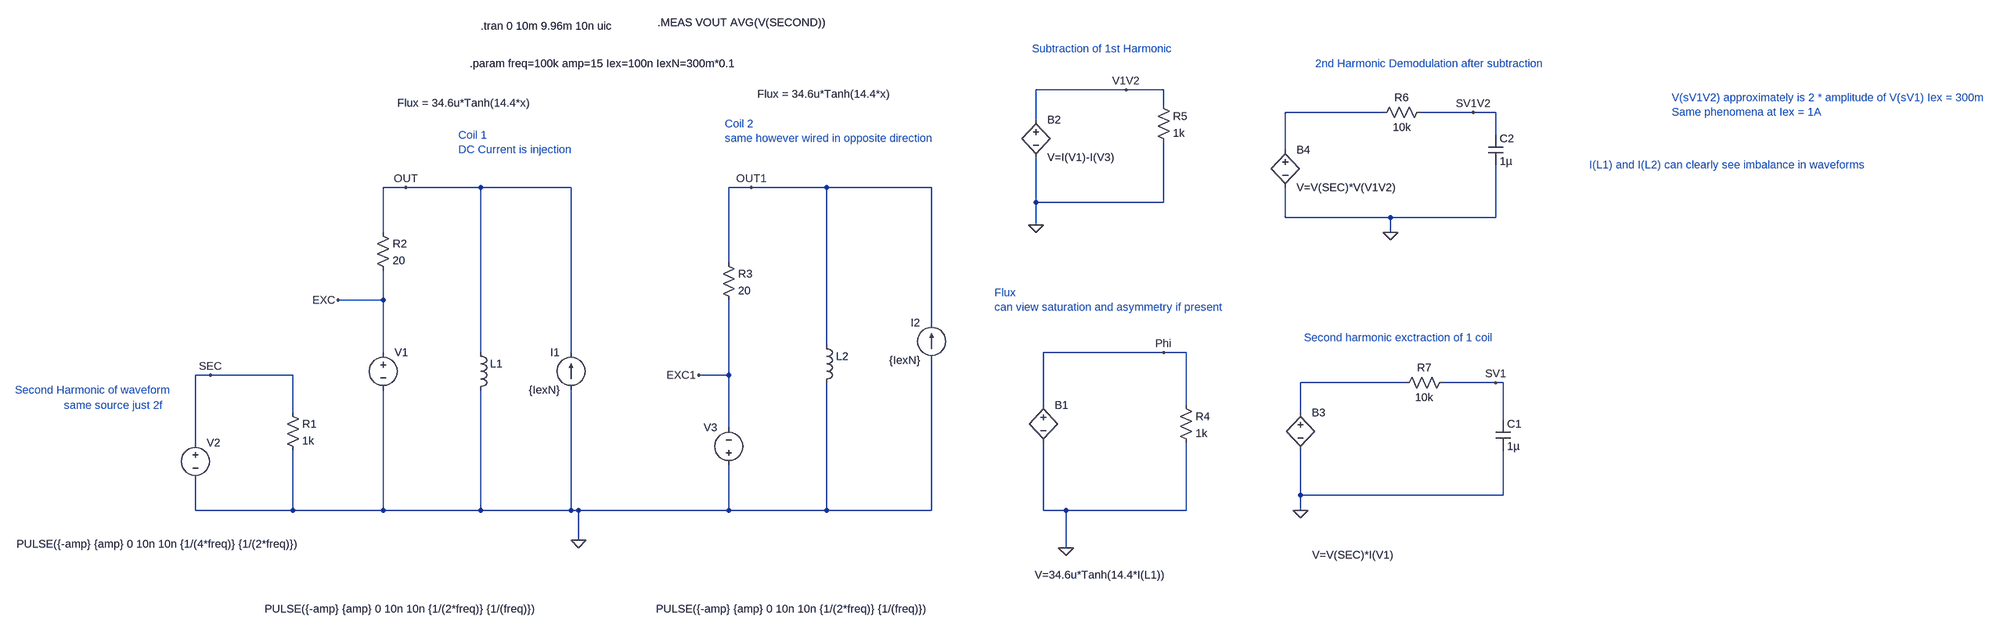
[diagram p0: schematic 2coilsby.asc]
2coilsby.asc, the LTspice schematic file:
Version 4
SHEET 1 3552 680
WIRE 1440 -752 1248 -752
WIRE 1520 -752 1440 -752
WIRE 1520 -720 1520 -752
WIRE 2064 -704 1856 -704
WIRE 2256 -704 2144 -704
WIRE 2304 -704 2256 -704
WIRE 1248 -688 1248 -752
WIRE 2304 -656 2304 -704
WIRE 1856 -624 1856 -704
WIRE -144 -544 -192 -544
WIRE 16 -544 -144 -544
WIRE 208 -544 16 -544
WIRE 592 -544 544 -544
WIRE 752 -544 592 -544
WIRE 976 -544 752 -544
WIRE 1248 -512 1248 -608
WIRE 1520 -512 1520 -640
WIRE 1520 -512 1248 -512
WIRE 1856 -480 1856 -544
WIRE 2080 -480 1856 -480
WIRE 2304 -480 2304 -592
WIRE 2304 -480 2080 -480
WIRE 1248 -464 1248 -512
WIRE -192 -448 -192 -544
WIRE 2080 -448 2080 -480
WIRE 544 -384 544 -544
WIRE -192 -304 -192 -368
WIRE -192 -304 -288 -304
WIRE 976 -256 976 -544
WIRE 752 -208 752 -544
WIRE -192 -192 -192 -304
WIRE 16 -192 16 -544
WIRE 208 -192 208 -544
WIRE 1520 -192 1264 -192
WIRE 1568 -192 1520 -192
WIRE -560 -144 -592 -144
WIRE -384 -144 -560 -144
WIRE 544 -144 544 -304
WIRE 544 -144 480 -144
WIRE 2112 -128 1888 -128
WIRE 2304 -128 2192 -128
WIRE 2320 -128 2304 -128
WIRE 1264 -80 1264 -192
WIRE 1568 -80 1568 -192
WIRE -384 -64 -384 -144
WIRE 1888 -64 1888 -128
WIRE 2320 -48 2320 -128
WIRE 544 -32 544 -144
WIRE -592 0 -592 -144
WIRE 1888 112 1888 16
WIRE 2320 112 2320 16
WIRE 2320 112 1888 112
WIRE -592 144 -592 80
WIRE -384 144 -384 16
WIRE -384 144 -592 144
WIRE -192 144 -192 -112
WIRE -192 144 -384 144
WIRE 16 144 16 -112
WIRE 16 144 -192 144
WIRE 208 144 208 -112
WIRE 208 144 16 144
WIRE 224 144 208 144
WIRE 544 144 544 48
WIRE 544 144 224 144
WIRE 752 144 752 -128
WIRE 752 144 544 144
WIRE 976 144 976 -176
WIRE 976 144 752 144
WIRE 1264 144 1264 0
WIRE 1312 144 1264 144
WIRE 1568 144 1568 0
WIRE 1568 144 1312 144
WIRE 1888 144 1888 112
WIRE 224 208 224 144
WIRE 1312 224 1312 144
FLAG 224 208 0
FLAG -288 -304 EXC
FLAG -144 -544 OUT
FLAG 480 -144 EXC1
FLAG 1248 -464 0
FLAG 2080 -448 0
FLAG 1312 224 0
FLAG 1888 144 0
FLAG -560 -144 SEC
FLAG 592 -544 OUT1
FLAG 1440 -752 V1V2
FLAG 2256 -704 SV1V2
FLAG 1520 -192 Phi
FLAG 2304 -128 SV1
SYMBOL voltage -192 -208 R0
WINDOW 3 -252 562 Left 2
WINDOW 123 0 0 Left 0
WINDOW 39 0 0 Left 0
SYMATTR Value PULSE({-amp} {amp} 0 10n 10n {1/(2*freq)} {1/(freq)})
SYMATTR InstName V1
SYMBOL voltage -592 -16 R0
WINDOW 3 -381 232 Left 2
SYMATTR Value PULSE({-amp} {amp} 0 10n 10n {1/(4*freq)} {1/(2*freq)})
SYMATTR InstName V2
SYMBOL voltage 544 64 R180
WINDOW 0 24 96 Left 2
WINDOW 3 -423 -290 Left 2
SYMATTR InstName V3
SYMATTR Value PULSE({-amp} {amp} 0 10n 10n {1/(2*freq)} {1/(freq)})
SYMBOL res -400 -80 R0
SYMATTR InstName R1
SYMATTR Value 1k
SYMBOL res -208 -464 R0
SYMATTR InstName R2
SYMATTR Value 20
SYMBOL ind 0 -208 R0
WINDOW 3 -162 -516 Left 2
SYMATTR Value Flux = 34.6u*Tanh(14.4*x)
SYMATTR InstName L1
SYMBOL current 208 -112 R180
WINDOW 0 24 80 Left 2
WINDOW 3 24 0 Left 2
WINDOW 123 0 0 Left 0
WINDOW 39 0 0 Left 0
SYMATTR InstName I1
SYMATTR Value {IexN}
SYMBOL res 528 -400 R0
SYMATTR InstName R3
SYMATTR Value 20
SYMBOL ind 736 -224 R0
WINDOW 3 -131 -519 Left 2
SYMATTR Value Flux = 34.6u*Tanh(14.4*x)
SYMATTR InstName L2
SYMBOL current 976 -176 R180
WINDOW 0 24 80 Left 2
WINDOW 3 24 0 Left 2
WINDOW 123 0 0 Left 0
WINDOW 39 0 0 Left 0
SYMATTR InstName I2
SYMATTR Value {IexN}
SYMBOL bv 1264 -96 R0
WINDOW 3 -18 378 Left 2
SYMATTR Value V=34.6u*Tanh(14.4*I(L1))
SYMATTR InstName B1
SYMBOL bv 1248 -704 R0
SYMATTR InstName B2
SYMATTR Value V=I(V1)-I(V3)
SYMBOL bv 1888 -80 R0
WINDOW 3 25 319 Left 2
SYMATTR Value V=V(SEC)*I(V1)
SYMATTR InstName B3
SYMBOL bv 1856 -640 R0
SYMATTR InstName B4
SYMATTR Value V=V(SEC)*V(V1V2)
SYMBOL res 1552 -96 R0
SYMATTR InstName R4
SYMATTR Value 1k
SYMBOL res 1504 -736 R0
SYMATTR InstName R5
SYMATTR Value 1k
SYMBOL res 2160 -720 R90
WINDOW 0 0 56 VBottom 2
WINDOW 3 32 56 VTop 2
SYMATTR InstName R6
SYMATTR Value 10k
SYMBOL res 2208 -144 R90
WINDOW 0 0 56 VBottom 2
WINDOW 3 32 56 VTop 2
SYMATTR InstName R7
SYMATTR Value 10k
SYMBOL cap 2304 -48 R0
SYMATTR InstName C1
SYMATTR Value 1µ
SYMBOL cap 2288 -656 R0
SYMATTR InstName C2
SYMATTR Value 1µ
TEXT -8 -808 Left 2 !.param freq=100k amp=15 Iex=100n IexN=300m*0.1
TEXT -976 -112 Left 2 ;Second Harmonic of waveform
TEXT -872 -80 Left 2 ;same source just 2f
TEXT -32 -656 Left 2 ;Coil 1\nDC Current is injection
TEXT 536 -680 Left 2 ;Coil 2 \nsame however wired in opposite direction
TEXT 16 -888 Left 2 !.tran 0 10m 9.96m 10n uic
TEXT 392 -896 Left 2 !.MEAS VOUT AVG(V(SECOND))
TEXT 1240 -840 Left 2 ;Subtraction of 1st Harmonic
TEXT 1920 -808 Left 2 ;2nd Harmonic Demodulation after subtraction
TEXT 1896 -224 Left 2 ;Second harmonic exctraction of 1 coil
TEXT 1160 -320 Left 2 ;Flux\ncan view saturation and asymmetry if present
TEXT 2816 -736 Left 2 ;V(sV1V2) approximately is 2 * amplitude of V(sV1) Iex = 300m\nSame phenomena at Iex = 1A
TEXT 2640 -592 Left 2 ;I(L1) and I(L2) can clearly see imbalance in waveforms

The netlist it stands for:
* 2coilsby.asc
V1 EXC 0 PULSE({-amp} {amp} 0 10n 10n {1/(2*freq)} {1/(freq)})
V2 SEC 0 PULSE({-amp} {amp} 0 10n 10n {1/(4*freq)} {1/(2*freq)})
V3 0 EXC1 PULSE({-amp} {amp} 0 10n 10n {1/(2*freq)} {1/(freq)})
R1 SEC 0 1k
R2 OUT EXC 20
L1 OUT 0 Flux = 34.6u*Tanh(14.4*x)
I1 0 OUT {IexN}
R3 OUT1 EXC1 20
L2 OUT1 0 Flux = 34.6u*Tanh(14.4*x)
I2 0 OUT1 {IexN}
B1 Phi 0 V=34.6u*Tanh(14.4*I(L1))
B2 V1V2 0 V=I(V1)-I(V3)
B3 N002 0 V=V(SEC)*I(V1)
B4 N001 0 V=V(SEC)*V(V1V2)
R4 Phi 0 1k
R5 V1V2 0 1k
R6 SV1V2 N001 10k
R7 SV1 N002 10k
C1 SV1 0 1µ
C2 SV1V2 0 1µ
.param freq=100k amp=15 Iex=100n IexN=300m*0.1
* Second Harmonic of waveform
* same source just 2f
* Coil 1
* DC Current is injection
* Coil 2
* same however wired in opposite direction
.tran 0 10m 9.96m 10n uic
.MEAS VOUT AVG(V(SECOND))
* Subtraction of 1st Harmonic
* 2nd Harmonic Demodulation after subtraction
* Second harmonic exctraction of 1 coil
* Flux
* can view saturation and asymmetry if present
* V(sV1V2) approximately is 2 * amplitude of V(sV1) Iex = 300m
* Same phenomena at Iex = 1A
* I(L1) and I(L2) can clearly see imbalance in waveforms
.backanno
.end